# EAGLE schematic circuit (EAGLE 6.5.0)

## Sheet 1 of 5: Controller
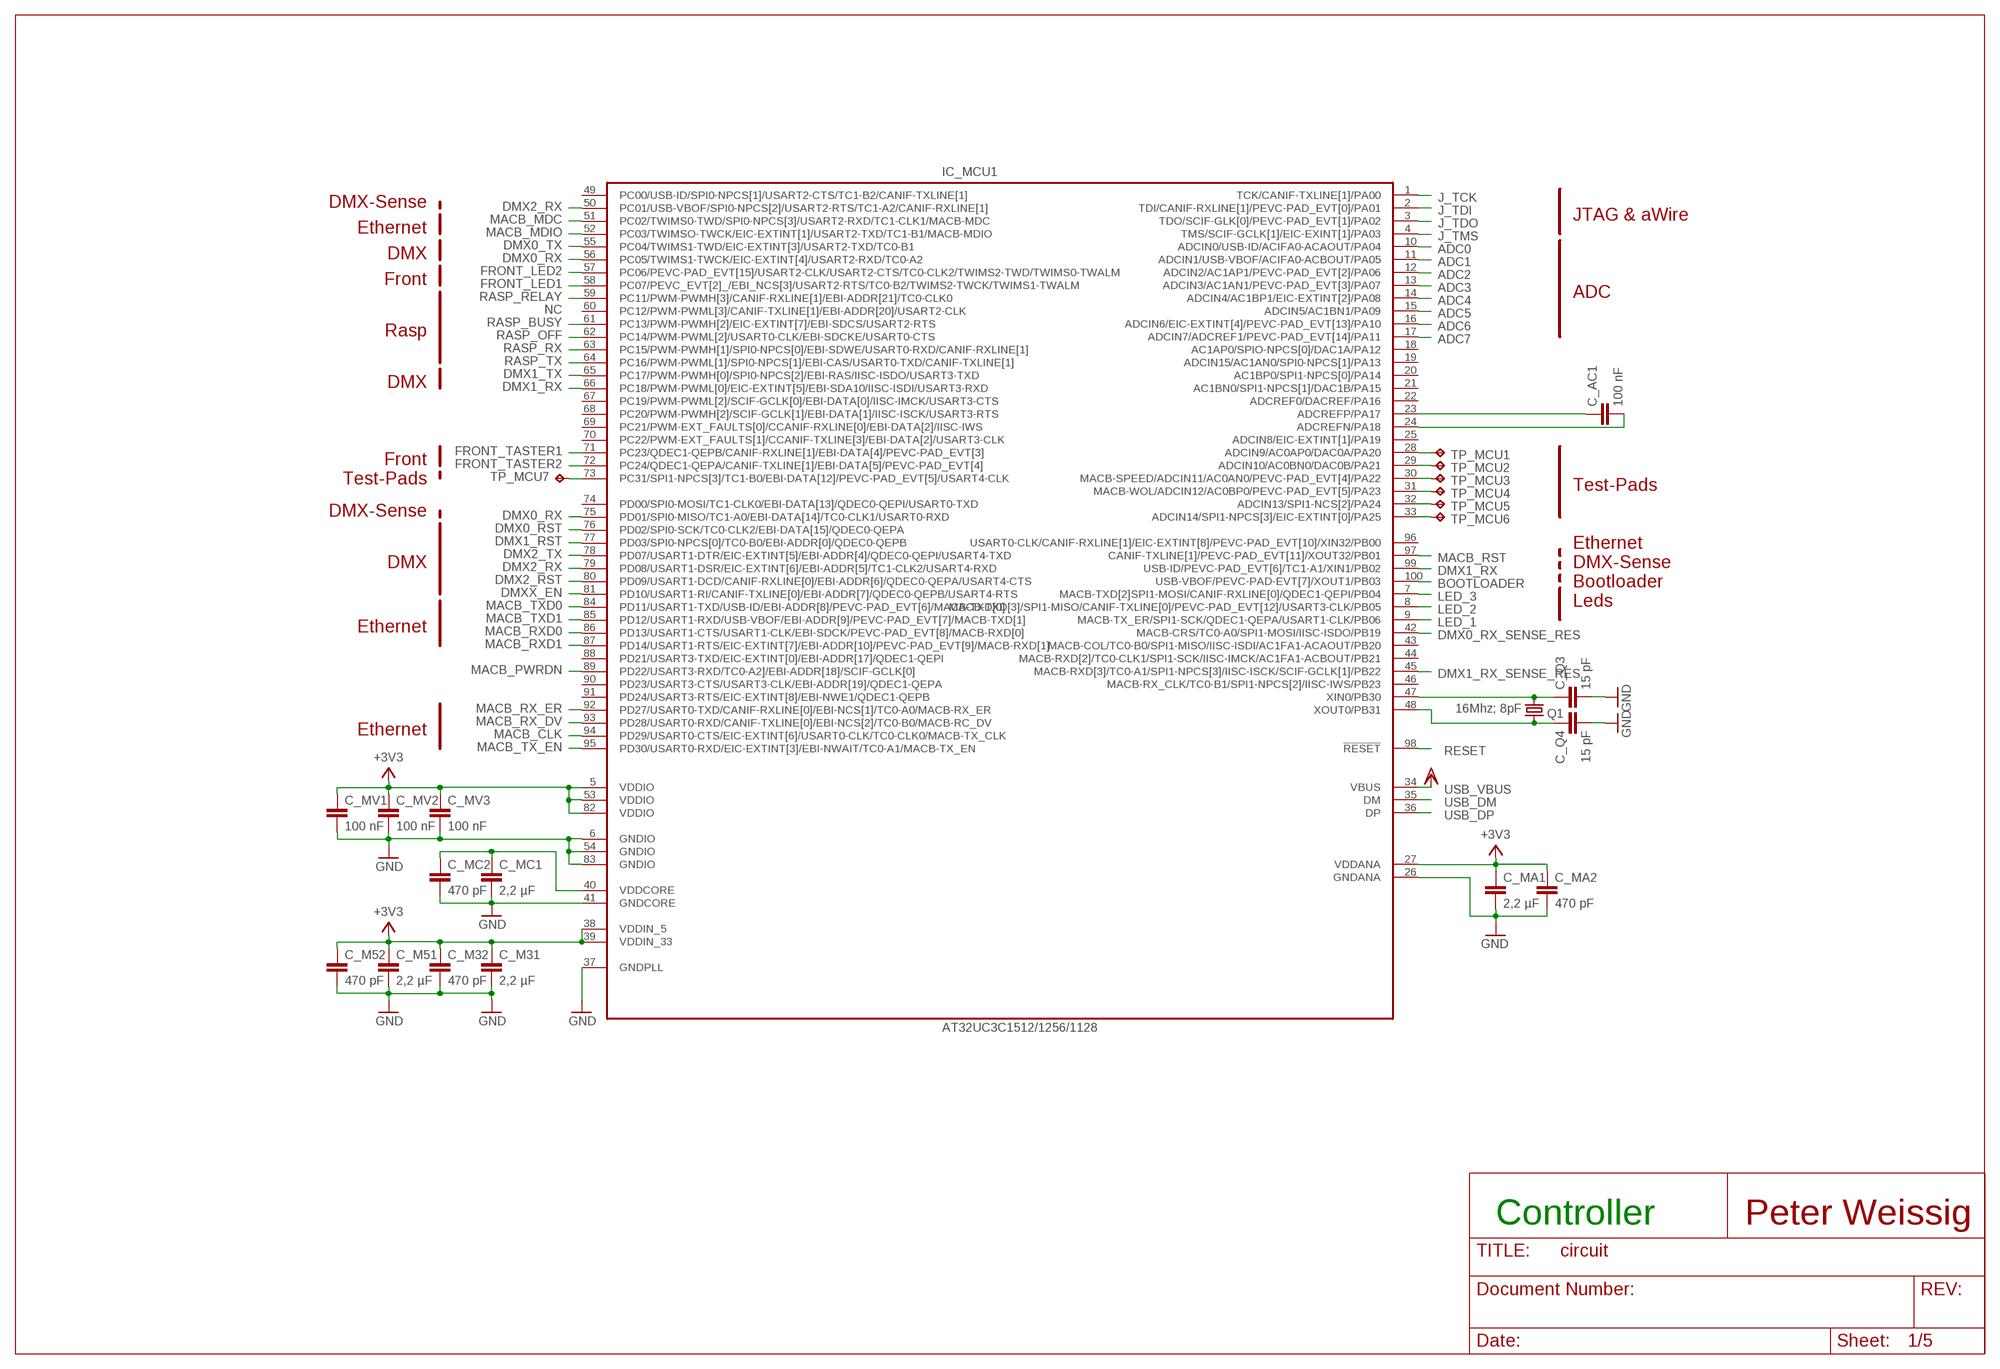
[diagram p0: schematic, sheet 1]

### Parts
C_AC1  100 nF  C-EUC0603K  [C0603K]
C_M31  2,2 µF  C-EUC0603K  [C0603K]
C_M32  470 pF  C-EUC0603K  [C0603K]
C_M51  2,2 µF  C-EUC0603K  [C0603K]
C_M52  470 pF  C-EUC0603K  [C0603K]
C_MA1  2,2 µF  C-EUC0603K  [C0603K]
C_MA2  470 pF  C-EUC0603K  [C0603K]
C_MC1  2,2 µF  C-EUC0603K  [C0603K]
C_MC2  470 pF  C-EUC0603K  [C0603K]
C_MV1  100 nF  C-EUC0603K  [C0603K]
C_MV2  100 nF  C-EUC0603K  [C0603K]
C_MV3  100 nF  C-EUC0603K  [C0603K]
C_Q3  15 pF  C-EUC0603K  [C0603K]
C_Q4  15 pF  C-EUC0603K  [C0603K]
IC_MCU1  AT32UC3C1512/1256/1128  [TQFP100]
Q1  16Mhz; 8pF  CRYSTALNX5032  [NX5032]
TP_MCU1  TPTP15R  [TP15R]
TP_MCU2  TPTP15R  [TP15R]
TP_MCU3  TPTP15R  [TP15R]
TP_MCU4  TPTP15R  [TP15R]
TP_MCU5  TPTP15R  [TP15R]
TP_MCU6  TPTP15R  [TP15R]
TP_MCU7  TPTP15R  [TP15R]

### Nets
+3V3: C_M31.1 C_M32.1 C_M51.1 C_M52.1 C_MA1.1 C_MA2.1 C_MV1.1 C_MV2.1 C_MV3.1 IC_MCU1.5(VDDIO) IC_MCU1.27(VDDANA) IC_MCU1.38(VDDIN_5) IC_MCU1.39(VDDIN_33) IC_MCU1.53(VDDIO) IC_MCU1.82(VDDIO) ; also sheet 2,3,4,5
ADC0: IC_MCU1.10(ADCIN0/USB-ID/ACIFA0-ACAOUT/PA04) ; also sheet 3
ADC1: IC_MCU1.11(ADCIN1/USB-VBOF/ACIFA0-ACBOUT/PA05) ; also sheet 3
ADC2: IC_MCU1.12(ADCIN2/AC1AP1/PEVC-PAD_EVT[2]/PA06) ; also sheet 3
ADC3: IC_MCU1.13(ADCIN3/AC1AN1/PEVC-PAD_EVT[3]/PA07) ; also sheet 3
ADC4: IC_MCU1.14(ADCIN4/AC1BP1/EIC-EXTINT[2]/PA08) ; also sheet 3
ADC5: IC_MCU1.15(ADCIN5/AC1BN1/PA09) ; also sheet 3
ADC6: IC_MCU1.16(ADCIN6/EIC-EXTINT[4]/PEVC-PAD_EVT[13]/PA10) ; also sheet 3
ADC7: IC_MCU1.17(ADCIN7/ADCREF1/PEVC-PAD_EVT[14]/PA11) ; also sheet 3
BOOTLOADER: IC_MCU1.100(USB-VBOF/PEVC-PAD-EVT[7]/XOUT1/PB03) ; also sheet 3
DMX0_RST: IC_MCU1.76(PD02/SPI0-SCK/TC0-CLK2/EBI-DATA[15]/QDEC0-QEPA) ; also sheet 4
DMX0_RX: IC_MCU1.56(PC05/TWIMS1-TWCK/EIC-EXTINT[4]/USART2-RXD/TC0-A2) IC_MCU1.75(PD01/SPI0-MISO/TC1-A0/EBI-DATA[14]/TC0-CLK1/USART0-RXD) ; also sheet 4
DMX0_RX_SENSE_RES: IC_MCU1.42(MACB-CRS/TC0-A0/SPI1-MOSI/IISC-ISDO/PB19)
DMX0_TX: IC_MCU1.55(PC04/TWIMS1-TWD/EIC-EXTINT[3]/USART2-TXD/TC0-B1) ; also sheet 4
DMX1_RST: IC_MCU1.77(PD03/SPI0-NPCS[0]/TC0-B0/EBI-ADDR[0]/QDEC0-QEPB) ; also sheet 4
DMX1_RX: IC_MCU1.66(PC18/PWM-PWML[0]/EIC-EXTINT[5]/EBI-SDA10/IISC-ISDI/USART3-RXD) IC_MCU1.99(USB-ID/PEVC-PAD_EVT[6]/TC1-A1/XIN1/PB02) ; also sheet 4
DMX1_RX_SENSE_RES: IC_MCU1.45(MACB-RXD[3]/TC0-A1/SPI1-NPCS[3]/IISC-ISCK/SCIF-GCLK[1]/PB22)
DMX1_TX: IC_MCU1.65(PC17/PWM-PWMH[0]/SPI0-NPCS[2]/EBI-RAS/IISC-ISDO/USART3-TXD) ; also sheet 4
DMX2_RST: IC_MCU1.80(PD09/USART1-DCD/CANIF-RXLINE[0]/EBI-ADDR[6]/QDEC0-QEPA/USART4-CTS) ; also sheet 4
DMX2_RX: IC_MCU1.50(PC01/USB-VBOF/SPI0-NPCS[2]/USART2-RTS/TC1-A2/CANIF-RXLINE[1]) IC_MCU1.79(PD08/USART1-DSR/EIC-EXTINT[6]/EBI-ADDR[5]/TC1-CLK2/USART4-RXD) ; also sheet 4
DMX2_TX: IC_MCU1.78(PD07/USART1-DTR/EIC-EXTINT[5]/EBI-ADDR[4]/QDEC0-QEPI/USART4-TXD) ; also sheet 4
DMXX_EN: IC_MCU1.81(PD10/USART1-RI/CANIF-TXLINE[0]/EBI-ADDR[7]/QDEC0-QEPB/USART4-RTS) ; also sheet 4
FRONT_LED1: IC_MCU1.58(PC07/PEVC_EVT[2]_/EBI_NCS[3]/USART2-RTS/TC0-B2/TWIMS2-TWCK/TWIMS1-TWALM) ; also sheet 3
FRONT_LED2: IC_MCU1.57(PC06/PEVC-PAD_EVT[15]/USART2-CLK/USART2-CTS/TC0-CLK2/TWIMS2-TWD/TWIMS0-TWALM) ; also sheet 3
FRONT_TASTER1: IC_MCU1.71(PC23/QDEC1-QEPB/CANIF-RXLINE[1]/EBI-DATA[4]/PEVC-PAD_EVT[3]) ; also sheet 3
FRONT_TASTER2: IC_MCU1.72(PC24/QDEC1-QEPA/CANIF-TXLINE[1]/EBI-DATA[5]/PEVC-PAD_EVT[4]) ; also sheet 3
FRONT_TASTER3: IC_MCU1.73(PC31/SPI1-NPCS[3]/TC1-B0/EBI-DATA[12]/PEVC-PAD_EVT[5]/USART4-CLK) TP_MCU7.TP
GND: C_M31.2 C_M32.2 C_M51.2 C_M52.2 C_MA1.2 C_MA2.2 C_MC1.2 C_MC2.2 C_MV1.2 C_MV2.2 C_MV3.2 C_Q3.2 C_Q4.2 IC_MCU1.6(GNDIO) IC_MCU1.26(GNDANA) IC_MCU1.37(GNDPLL) IC_MCU1.41(GNDCORE) IC_MCU1.54(GNDIO) IC_MCU1.83(GNDIO) ; also sheet 2,3,4,5
J_TCK: IC_MCU1.1(TCK/CANIF-TXLINE[1]/PA00) ; also sheet 3
J_TDI: IC_MCU1.2(TDI/CANIF-RXLINE[1]/PEVC-PAD_EVT[0]/PA01) ; also sheet 3
J_TDO: IC_MCU1.3(TDO/SCIF-GLK[0]/PEVC-PAD_EVT[1]/PA02) ; also sheet 3
J_TMS: IC_MCU1.4(TMS/SCIF-GCLK[1]/EIC-EXINT[1]/PA03) ; also sheet 3
LED_1: IC_MCU1.9(MACB-TX_ER/SPI1-SCK/QDEC1-QEPA/USART1-CLK/PB06) ; also sheet 3
LED_2: IC_MCU1.8(MACB-TXD[3]/SPI1-MISO/CANIF-TXLINE[0]/PEVC-PAD_EVT[12]/USART3-CLK/PB05) ; also sheet 3
LED_3: IC_MCU1.7(MACB-TXD[2]SPI1-MOSI/CANIF-RXLINE[0]/QDEC1-QEPI/PB04) ; also sheet 3
MACB_CLK: IC_MCU1.94(PD29/USART0-CTS/EIC-EXTINT[6]/USART0-CLK/TC0-CLK0/MACB-TX_CLK) ; also sheet 2
MACB_MDC: IC_MCU1.51(PC02/TWIMS0-TWD/SPI0-NPCS[3]/USART2-RXD/TC1-CLK1/MACB-MDC) ; also sheet 2
MACB_MDIO: IC_MCU1.52(PC03/TWIMSO-TWCK/EIC-EXTINT[1]/USART2-TXD/TC1-B1/MACB-MDIO) ; also sheet 2
MACB_PWRDN: IC_MCU1.89(PD22/USART3-RXD/TC0-A2]/EBI-ADDR[18]/SCIF-GCLK[0]) ; also sheet 2
MACB_RST: IC_MCU1.97(CANIF-TXLINE[1]/PEVC-PAD_EVT[11]/XOUT32/PB01) ; also sheet 2
MACB_RX_DV: IC_MCU1.93(PD28/USART0-RXD/CANIF-TXLINE[0]/EBI-NCS[2]/TC0-B0/MACB-RC_DV) ; also sheet 2
MACB_RX_ER: IC_MCU1.92(PD27/USART0-TXD/CANIF-RXLINE[0]/EBI-NCS[1]/TC0-A0/MACB-RX_ER) ; also sheet 2
MACB_RXD0: IC_MCU1.86(PD13/USART1-CTS/USART1-CLK/EBI-SDCK/PEVC-PAD_EVT[8]/MACB-RXD[0]) ; also sheet 2
MACB_RXD1: IC_MCU1.87(PD14/USART1-RTS/EIC-EXTINT[7]/EBI-ADDR[10]/PEVC-PAD_EVT[9]/MACB-RXD[1]) ; also sheet 2
MACB_TX_EN: IC_MCU1.95(PD30/USART0-RXD/EIC-EXTINT[3]/EBI-NWAIT/TC0-A1/MACB-TX_EN) ; also sheet 2
MACB_TXD0: IC_MCU1.84(PD11/USART1-TXD/USB-ID/EBI-ADDR[8]/PEVC-PAD_EVT[6]/MACB-TXD[0]) ; also sheet 2
MACB_TXD1: IC_MCU1.85(PD12/USART1-RXD/USB-VBOF/EBI-ADDR[9]/PEVC-PAD_EVT[7]/MACB-TXD[1]) ; also sheet 2
N$1: C_MC1.1 C_MC2.1 IC_MCU1.40(VDDCORE)
N$2: C_Q3.1 IC_MCU1.47(XIN0/PB30) Q1.2
N$4: IC_MCU1.28(ADCIN9/AC0AP0/DAC0A/PA20) TP_MCU1.TP
N$6: C_Q4.1 IC_MCU1.48(XOUT0/PB31) Q1.1
N$11: IC_MCU1.29(ADCIN10/AC0BN0/DAC0B/PA21) TP_MCU2.TP
N$13: IC_MCU1.30(MACB-SPEED/ADCIN11/AC0AN0/PEVC-PAD_EVT[4]/PA22) TP_MCU3.TP
N$25: C_AC1.1 IC_MCU1.23(ADCREFP/PA17)
N$26: C_AC1.2 IC_MCU1.24(ADCREFN/PA18)
N$30: IC_MCU1.31(MACB-WOL/ADCIN12/AC0BP0/PEVC-PAD_EVT[5]/PA23) TP_MCU4.TP
N$31: IC_MCU1.32(ADCIN13/SPI1-NCS[2]/PA24) TP_MCU5.TP
N$32: IC_MCU1.33(ADCIN14/SPI1-NPCS[3]/EIC-EXTINT[0]/PA25) TP_MCU6.TP
RASP_BUSY: IC_MCU1.61(PC13/PWM-PWMH[2]/EIC-EXTINT[7]/EBI-SDCS/USART2-RTS) ; also sheet 5
RASP_OFF: IC_MCU1.62(PC14/PWM-PWML[2]/USART0-CLK/EBI-SDCKE/USART0-CTS) ; also sheet 5
RASP_RELAY: IC_MCU1.59(PC11/PWM-PWMH[3]/CANIF-RXLINE[1]/EBI-ADDR[21]/TC0-CLK0) ; also sheet 3
RASP_RX: IC_MCU1.63(PC15/PWM-PWMH[1]/SPI0-NPCS[0]/EBI-SDWE/USART0-RXD/CANIF-RXLINE[1]) ; also sheet 5
RASP_TX: IC_MCU1.64(PC16/PWM-PWML[1]/SPI0-NPCS[1]/EBI-CAS/USART0-TXD/CANIF-TXLINE[1]) ; also sheet 5
RESET: IC_MCU1.98(!RESET) ; also sheet 3
USB_DM: IC_MCU1.35(DM) ; also sheet 3
USB_DP: IC_MCU1.36(DP) ; also sheet 3
USB_VBUS: IC_MCU1.34(VBUS) ; supply symbol labelled VDD ; also sheet 3
Unconnected: IC_MCU1.18(AC1AP0/SPIO-NPCS[0]/DAC1A/PA12) IC_MCU1.19(ADCIN15/AC1AN0/SPI0-NPCS[1]/PA13) IC_MCU1.20(AC1BP0/SPI1-NPCS[0]/PA14) IC_MCU1.21(AC1BN0/SPI1-NPCS[1]/DAC1B/PA15) IC_MCU1.22(ADCREF0/DACREF/PA16) IC_MCU1.25(ADCIN8/EIC-EXTINT[1]/PA19) IC_MCU1.43(MACB-COL/TC0-B0/SPI1-MISO/IISC-ISDI/AC1FA1-ACAOUT/PB20) IC_MCU1.44(MACB-RXD[2]/TC0-CLK1/SPI1-SCK/IISC-IMCK/AC1FA1-ACBOUT/PB21) IC_MCU1.46(MACB-RX_CLK/TC0-B1/SPI1-NPCS[2]/IISC-IWS/PB23) IC_MCU1.49(PC00/USB-ID/SPI0-NPCS[1]/USART2-CTS/TC1-B2/CANIF-TXLINE[1]) IC_MCU1.60(PC12/PWM-PWML[3]/CANIF-TXLINE[1]/EBI-ADDR[20]/USART2-CLK) IC_MCU1.67(PC19/PWM-PWML[2]/SCIF-GCLK[0]/EBI-DATA[0]/IISC-IMCK/USART3-CTS) IC_MCU1.68(PC20/PWM-PWMH[2]/SCIF-GCLK[1]/EBI-DATA[1]/IISC-ISCK/USART3-RTS) IC_MCU1.69(PC21/PWM-EXT_FAULTS[0]/CCANIF-RXLINE[0]/EBI-DATA[2]/IISC-IWS) IC_MCU1.70(PC22/PWM-EXT_FAULTS[1]/CCANIF-TXLINE[3]/EBI-DATA[2]/USART3-CLK) IC_MCU1.74(PD00/SPI0-MOSI/TC1-CLK0/EBI-DATA[13]/QDEC0-QEPI/USART0-TXD) IC_MCU1.88(PD21/USART3-TXD/EIC-EXTINT[0]/EBI-ADDR[17]/QDEC1-QEPI) IC_MCU1.90(PD23/USART3-CTS/USART3-CLK/EBI-ADDR[19]/QDEC1-QEPA) IC_MCU1.91(PD24/USART3-RTS/EIC-EXTINT[8]/EBI-NWE1/QDEC1-QEPB) IC_MCU1.96(USART0-CLK/CANIF-RXLINE[1]/EIC-EXTINT[8]/PEVC-PAD_EVT[10]/XIN32/PB00)

### Notes on the sheet
- DMX-Sense
- JTAG & aWire
- Ethernet
- DMX
- Front
- ADC
- NC
- Rasp
- DMX
- Front
- Test-Pads
- Test-Pads
- DMX-Sense
- Ethernet
- DMX | DMX-Sense
- Bootloader
- Leds
- Ethernet
- Ethernet
- Controller | Peter Weissig

## Sheet 2 of 5: Ethernet
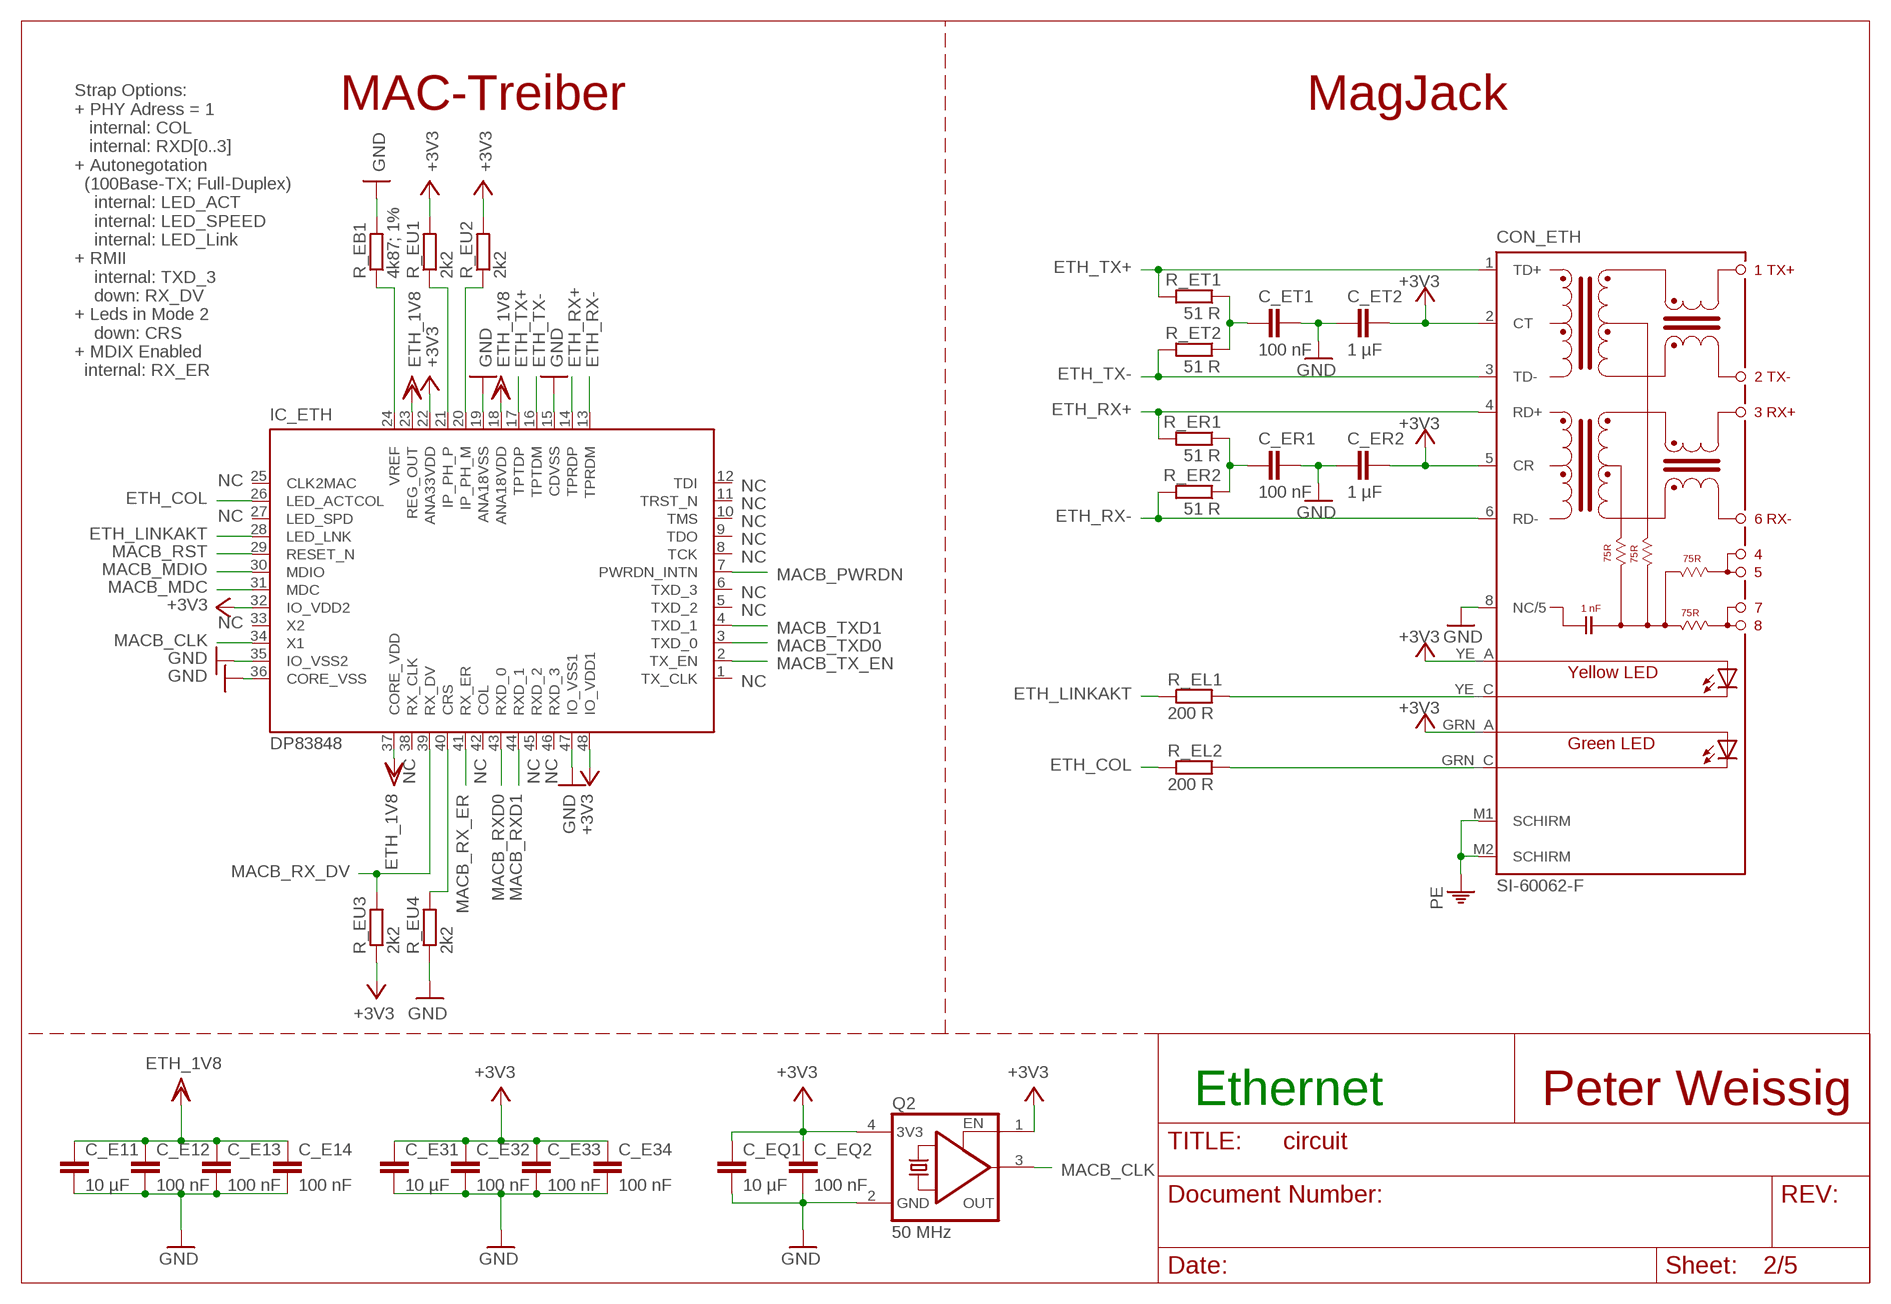
[diagram p1: schematic, sheet 2]

### Parts
C_E11  10 µF  C-EUC0603  [C0603]
C_E12  100 nF  C-EUC0603  [C0603]
C_E13  100 nF  C-EUC0603  [C0603]
C_E14  100 nF  C-EUC0603  [C0603]
C_E31  10 µF  C-EUC0603  [C0603]
C_E32  100 nF  C-EUC0603  [C0603]
C_E33  100 nF  C-EUC0603  [C0603]
C_E34  100 nF  C-EUC0603  [C0603]
C_EQ1  10 µF  C-EUC0603  [C0603]
C_EQ2  100 nF  C-EUC0603  [C0603]
C_ER1  100 nF  C-EUC0603  [C0603]
C_ER2  1 µF  C-EUC0603  [C0603]
C_ET1  100 nF  C-EUC0603  [C0603]
C_ET2  1 µF  C-EUC0603  [C0603]
CON_ETH  SI-60062-F  [MAG_JACK]
IC_ETH  DP83848  [LQFP48]
Q2  50 MHz  OSZILLATOR  [XO53]
R_EB1  4k87; 1%  R-EU_R0603  [R0603]
R_EL1  200 R  R-EU_R0603  [R0603]
R_EL2  200 R  R-EU_R0603  [R0603]
R_ER1  51 R  R-EU_R0603  [R0603]
R_ER2  51 R  R-EU_R0603  [R0603]
R_ET1  51 R  R-EU_R0603  [R0603]
R_ET2  51 R  R-EU_R0603  [R0603]
R_EU1  2k2  R-EU_R0603  [R0603]
R_EU2  2k2  R-EU_R0603  [R0603]
R_EU3  2k2  R-EU_R0603  [R0603]
R_EU4  2k2  R-EU_R0603  [R0603]

### Nets
+3V3: C_E31.1 C_E32.1 C_E33.1 C_E34.1 C_EQ1.1 C_EQ2.1 C_ER2.2 C_ET2.2 CON_ETH.2(CT) CON_ETH.5(CR) CON_ETH.GRN_A(AL) CON_ETH.YE_A(A-R) IC_ETH.22(ANA33VDD) IC_ETH.32(IO_VDD2) IC_ETH.48(IO_VDD1) Q2.1(EN) Q2.4(3V3) R_EU1.2 R_EU2.2 R_EU3.1 ; also sheet 1,3,4,5
ETH_1V8: C_E11.1 C_E12.1 C_E13.1 C_E14.1 IC_ETH.18(ANA18VDD) IC_ETH.23(REG_OUT) IC_ETH.37(CORE_VDD) ; supply symbol labelled VDD
ETH_COL: IC_ETH.26(LED_ACTCOL) R_EL2.1
ETH_LINKAKT: IC_ETH.28(LED_LNK) R_EL1.1
ETH_RX+: CON_ETH.4(RD+) IC_ETH.14(TPRDP) R_ER1.2
ETH_RX-: CON_ETH.6(RD-) IC_ETH.13(TPRDM) R_ER2.2
ETH_TX+: CON_ETH.1(TD+) IC_ETH.17(TPTDP) R_ET1.2
ETH_TX-: CON_ETH.3(TD-) IC_ETH.16(TPTDM) R_ET2.2
GND: C_E11.2 C_E12.2 C_E13.2 C_E14.2 C_E31.2 C_E32.2 C_E33.2 C_E34.2 C_EQ1.2 C_EQ2.2 C_ER1.2 C_ER2.1 C_ET1.2 C_ET2.1 CON_ETH.8(NC/5) IC_ETH.15(CDVSS) IC_ETH.19(ANA18VSS) IC_ETH.35(IO_VSS2) IC_ETH.36(CORE_VSS) IC_ETH.47(IO_VSS1) Q2.2(GND) R_EB1.2 R_EU4.1 ; also sheet 1,3,4,5
MACB_CLK: IC_ETH.34(X1) Q2.3(OUT) ; also sheet 1
MACB_MDC: IC_ETH.31(MDC) ; also sheet 1
MACB_MDIO: IC_ETH.30(MDIO) ; also sheet 1
MACB_PWRDN: IC_ETH.7(PWRDN_INTN) ; also sheet 1
MACB_RST: IC_ETH.29(RESET_N) ; also sheet 1
MACB_RX_DV: IC_ETH.39(RX_DV) R_EU3.2 ; also sheet 1
MACB_RX_ER: IC_ETH.41(RX_ER) ; also sheet 1
MACB_RXD0: IC_ETH.43(RXD_0) ; also sheet 1
MACB_RXD1: IC_ETH.44(RXD_1) ; also sheet 1
MACB_TX_EN: IC_ETH.2(TX_EN) ; also sheet 1
MACB_TXD0: IC_ETH.3(TXD_0) ; also sheet 1
MACB_TXD1: IC_ETH.4(TXD_1) ; also sheet 1
N$14: IC_ETH.24(VREF) R_EB1.1
N$15: IC_ETH.21(IP_PH_P) R_EU1.1
N$16: IC_ETH.20(IP_PH_M) R_EU2.1
N$17: IC_ETH.40(CRS) R_EU4.2
N$41: CON_ETH.YE_C(C-R) R_EL1.2
N$42: CON_ETH.GRN_C(C-L) R_EL2.2
N$43: C_ER1.1 R_ER1.1 R_ER2.1
N$44: C_ET1.1 R_ET1.1 R_ET2.1
PE: CON_ETH.M1(SCHIRM) CON_ETH.M2(SCHIRM) ; also sheet 3,5
Unconnected: IC_ETH.1(TX_CLK) IC_ETH.5(TXD_2) IC_ETH.6(TXD_3) IC_ETH.8(TCK) IC_ETH.9(TDO) IC_ETH.10(TMS) IC_ETH.11(TRST_N) IC_ETH.12(TDI) IC_ETH.25(CLK2MAC) IC_ETH.27(LED_SPD) IC_ETH.33(X2) IC_ETH.38(RX_CLK) IC_ETH.42(COL) IC_ETH.45(RXD_2) IC_ETH.46(RXD_3)

### Notes on the sheet
- MAC-Treiber | MagJack
- ETH_1V8 | ETH_1V8
- Strap Options:
  + PHY Adress = 1
     internal: COL
     internal: RXD[0..3]
  + Autonegotation
    (100Base-TX; Full-Duplex)
      internal: LED_ACT
      internal: LED_SPEED
      internal: LED_Link
  + RMII
      internal: TXD_3
      down: RX_DV
  + Leds in Mode 2
      down: CRS
  + MDIX Enabled
    internal: RX_ER
- NC
- NC
- NC | NC
- NC
- NC
- NC
- NC
- NC | NC
- NC
- NC | NC | NC | NC
- ETH_1V8
- ETH_1V8
- Ethernet | Peter Weissig

## Sheet 3 of 5: Schnittstellen
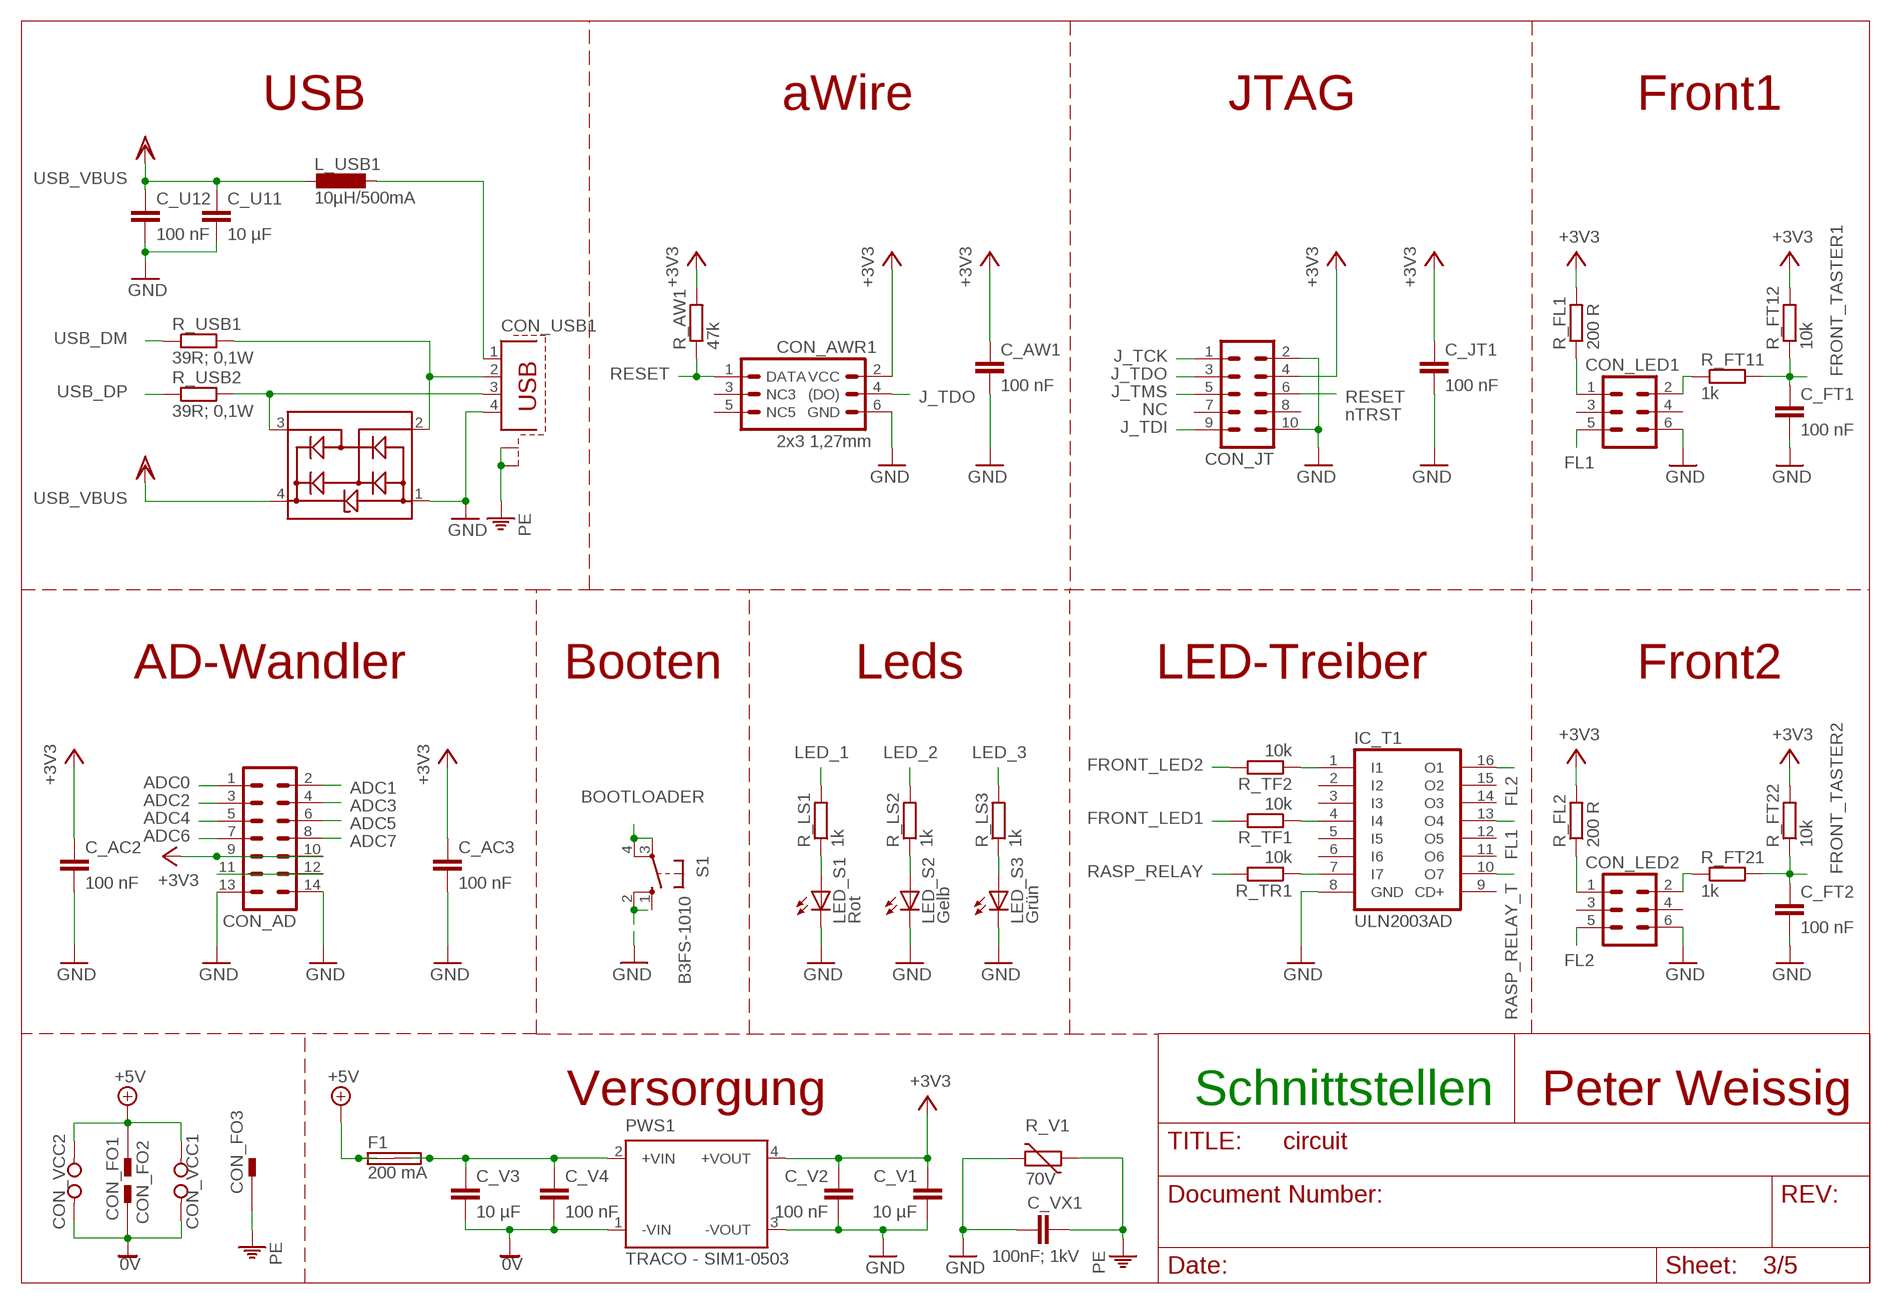
[diagram p2: schematic, sheet 3]

### Parts
C_AC2  100 nF  C-EUC0603K  [C0603K]
C_AC3  100 nF  C-EUC0603K  [C0603K]
C_AW1  100 nF  C-EUC0603K  [C0603K]
C_FT1  100 nF  C-EUC0603K  [C0603K]
C_FT2  100 nF  C-EUC0603K  [C0603K]
C_JT1  100 nF  C-EUC0603K  [C0603K]
C_U11  10 µF  C-EUC0805K  [C0805K]
C_U12  100 nF  C-EUC0603K  [C0603K]
C_V1  10 µF  C-EUC0603K  [C0603K]
C_V2  100 nF  C-EUC0603K  [C0603K]
C_V3  10 µF  C-EUC0603K  [C0603K]
C_V4  100 nF  C-EUC0603K  [C0603K]
C_VX1  100nF; 1kV  C-EUC1812K  [C1812K]
CON_AD  ML14  [ML14]
CON_AWR1  2x3 1,27mm  AWIREMINI  [2X3_MINI]
CON_FO1  PIN2F061.100  [F061.100]
CON_FO2  PIN2F061.100  [F061.100]
CON_FO3  PIN2F061.100  [F061.100]
CON_JT  ML10  [ML10]
CON_LED1  ML6  [ML6]
CON_LED2  ML6  [ML6]
CON_USB1  PN61729-S  [PN61729-S]
CON_VCC1  W237-02P  [W237-132]
CON_VCC2  W237-02P  [W237-132]
D1  PRTR5V0U2X  [SOT143-R]
F1  200 mA  SHK20L  [SHK20L]
IC_T1  ULN2003AD  [SO16]
L_USB1  10µH/500mA  L-EUL1210  [L1210]
LED_S1  Rot  LEDCHIPLED_1206  [CHIPLED_1206]
LED_S2  Gelb  LEDCHIPLED_1206  [CHIPLED_1206]
LED_S3  Grün  LEDCHIPLED_1206  [CHIPLED_1206]
PWS1  TRACO - SIM1-0503  TRACO-TME1  [TRACO_TME_1]
R_AW1  47k  R-EU_R0603  [R0603]
R_FL1  200 R  R-EU_R0603  [R0603]
R_FL2  200 R  R-EU_R0603  [R0603]
R_FT11  1k  R-EU_R0603  [R0603]
R_FT12  10k  R-EU_R0603  [R0603]
R_FT21  1k  R-EU_R0603  [R0603]
R_FT22  10k  R-EU_R0603  [R0603]
R_LS1  1k  R-EU_R0603  [R0603]
R_LS2  1k  R-EU_R0603  [R0603]
R_LS3  1k  R-EU_R0603  [R0603]
R_TF1  10k  R-EU_R0603  [R0603]
R_TF2  10k  R-EU_R0603  [R0603]
R_TR1  10k  R-EU_R0603  [R0603]
R_USB1  39R; 0,1W  R-EU_R0603  [R0603]
R_USB2  39R; 0,1W  R-EU_R0603  [R0603]
R_V1  70V  VARISTORCN1206  [CT/CN1206]
S1  B3FS-1010  10-XX  [B3F-10XX]

### Nets
0V: C_V3.2 C_V4.2 CON_FO1.A1 CON_FO1.A2 CON_VCC1.2 CON_VCC2.2 PWS1.1(-VIN) ; also sheet 4,5
+3V3: C_AC2.1 C_AC3.1 C_AW1.1 C_JT1.1 C_V1.1 C_V2.1 CON_AD.9 CON_AD.10 CON_AWR1.2(VCC) CON_JT.4 PWS1.4(+VOUT) R_AW1.2 R_FL1.2 R_FL2.2 R_FT12.2 R_FT22.2 ; also sheet 1,2,4,5
+5V: CON_FO2.A1 CON_FO2.A2 CON_VCC1.1 CON_VCC2.1 F1.1A F1.1B ; also sheet 4,5
ADC0: CON_AD.1 ; also sheet 1
ADC1: CON_AD.2 ; also sheet 1
ADC2: CON_AD.3 ; also sheet 1
ADC3: CON_AD.4 ; also sheet 1
ADC4: CON_AD.5 ; also sheet 1
ADC5: CON_AD.6 ; also sheet 1
ADC6: CON_AD.7 ; also sheet 1
ADC7: CON_AD.8 ; also sheet 1
BOOTLOADER: S1.3(P) S1.4(P1) ; also sheet 1
FL1: CON_LED1.5 IC_T1.13(O4)
FL2: CON_LED2.5 IC_T1.16(O1)
FRONT_LED1: R_TF1.2 ; also sheet 1
FRONT_LED2: R_TF2.2 ; also sheet 1
FRONT_TASTER1: C_FT1.1 R_FT11.2 R_FT12.1 ; also sheet 1
FRONT_TASTER2: C_FT2.1 R_FT21.2 R_FT22.1 ; also sheet 1
GND: C_AC2.2 C_AC3.2 C_AW1.2 C_FT1.2 C_FT2.2 C_JT1.2 C_U11.2 C_U12.2 C_V1.2 C_V2.2 C_VX1.1 CON_AD.13 CON_AD.14 CON_AWR1.6(GND) CON_JT.2 CON_JT.10 CON_LED1.6 CON_LED2.6 CON_USB1.4 D1.1(GND) IC_T1.8(GND) LED_S1.C LED_S2.C LED_S3.C PWS1.3(-VOUT) R_V1.2 S1.1(S) S1.2(S1) ; also sheet 1,2,4,5
J_TCK: CON_JT.1 ; also sheet 1
J_TDI: CON_JT.9 ; also sheet 1
J_TDO: CON_AWR1.4((DO)) CON_JT.3 ; also sheet 1
J_TMS: CON_JT.5 ; also sheet 1
LED_1: R_LS1.2 ; also sheet 1
LED_2: R_LS2.2 ; also sheet 1
LED_3: R_LS3.2 ; also sheet 1
N$3: LED_S1.A R_LS1.1
N$7: LED_S2.A R_LS2.1
N$8: CON_USB1.3 D1.3(IN/OUT2) R_USB2.2
N$9: CON_USB1.2 D1.2(IN/OUT1) R_USB1.2
N$10: LED_S3.A R_LS3.1
N$12: CON_USB1.1 L_USB1.1
N$27: CON_AD.11 CON_AD.12
N$28: IC_T1.4(I4) R_TF1.1
N$33: CON_LED1.1 R_FL1.1
N$35: C_V3.1 C_V4.1 F1.2A F1.2B PWS1.2(+VIN)
N$37: CON_LED1.2 R_FT11.1
N$46: CON_LED2.1 R_FL2.1
N$47: CON_LED2.2 R_FT21.1
N$48: IC_T1.1(I1) R_TF2.1
N$49: IC_T1.7(I7) R_TR1.1
PE: C_VX1.2 CON_FO3.A1 CON_FO3.A2 CON_USB1.S1 CON_USB1.S2 R_V1.1 ; also sheet 2,5
RASP_RELAY: R_TR1.2 ; also sheet 1
RASP_RELAY_T: IC_T1.10(O7) ; also sheet 5
RESET: CON_AWR1.1(DATA) CON_JT.6 R_AW1.1 ; also sheet 1
USB_DM: R_USB1.1 ; also sheet 1
USB_DP: R_USB2.1 ; also sheet 1
USB_VBUS: C_U11.1 C_U12.1 D1.4(VDD) L_USB1.2 ; supply symbol labelled VDD ; also sheet 1
Unconnected: CON_AWR1.3(NC3) CON_AWR1.5(NC5) CON_JT.7 CON_JT.8 CON_LED1.3 CON_LED1.4 CON_LED2.3 CON_LED2.4 IC_T1.2(I2) IC_T1.3(I3) IC_T1.5(I5) IC_T1.6(I6) IC_T1.9(CD+) IC_T1.11(O6) IC_T1.12(O5) IC_T1.14(O3) IC_T1.15(O2)

### Notes on the sheet
- USB | aWire | JTAG | Front1
- NC
- nTRST
- AD-Wandler | Booten | Leds | LED-Treiber | Front2
- Versorgung | Schnittstellen | Peter Weissig
- CON_VCC2 | CON_VCC1

## Sheet 4 of 5: DMX
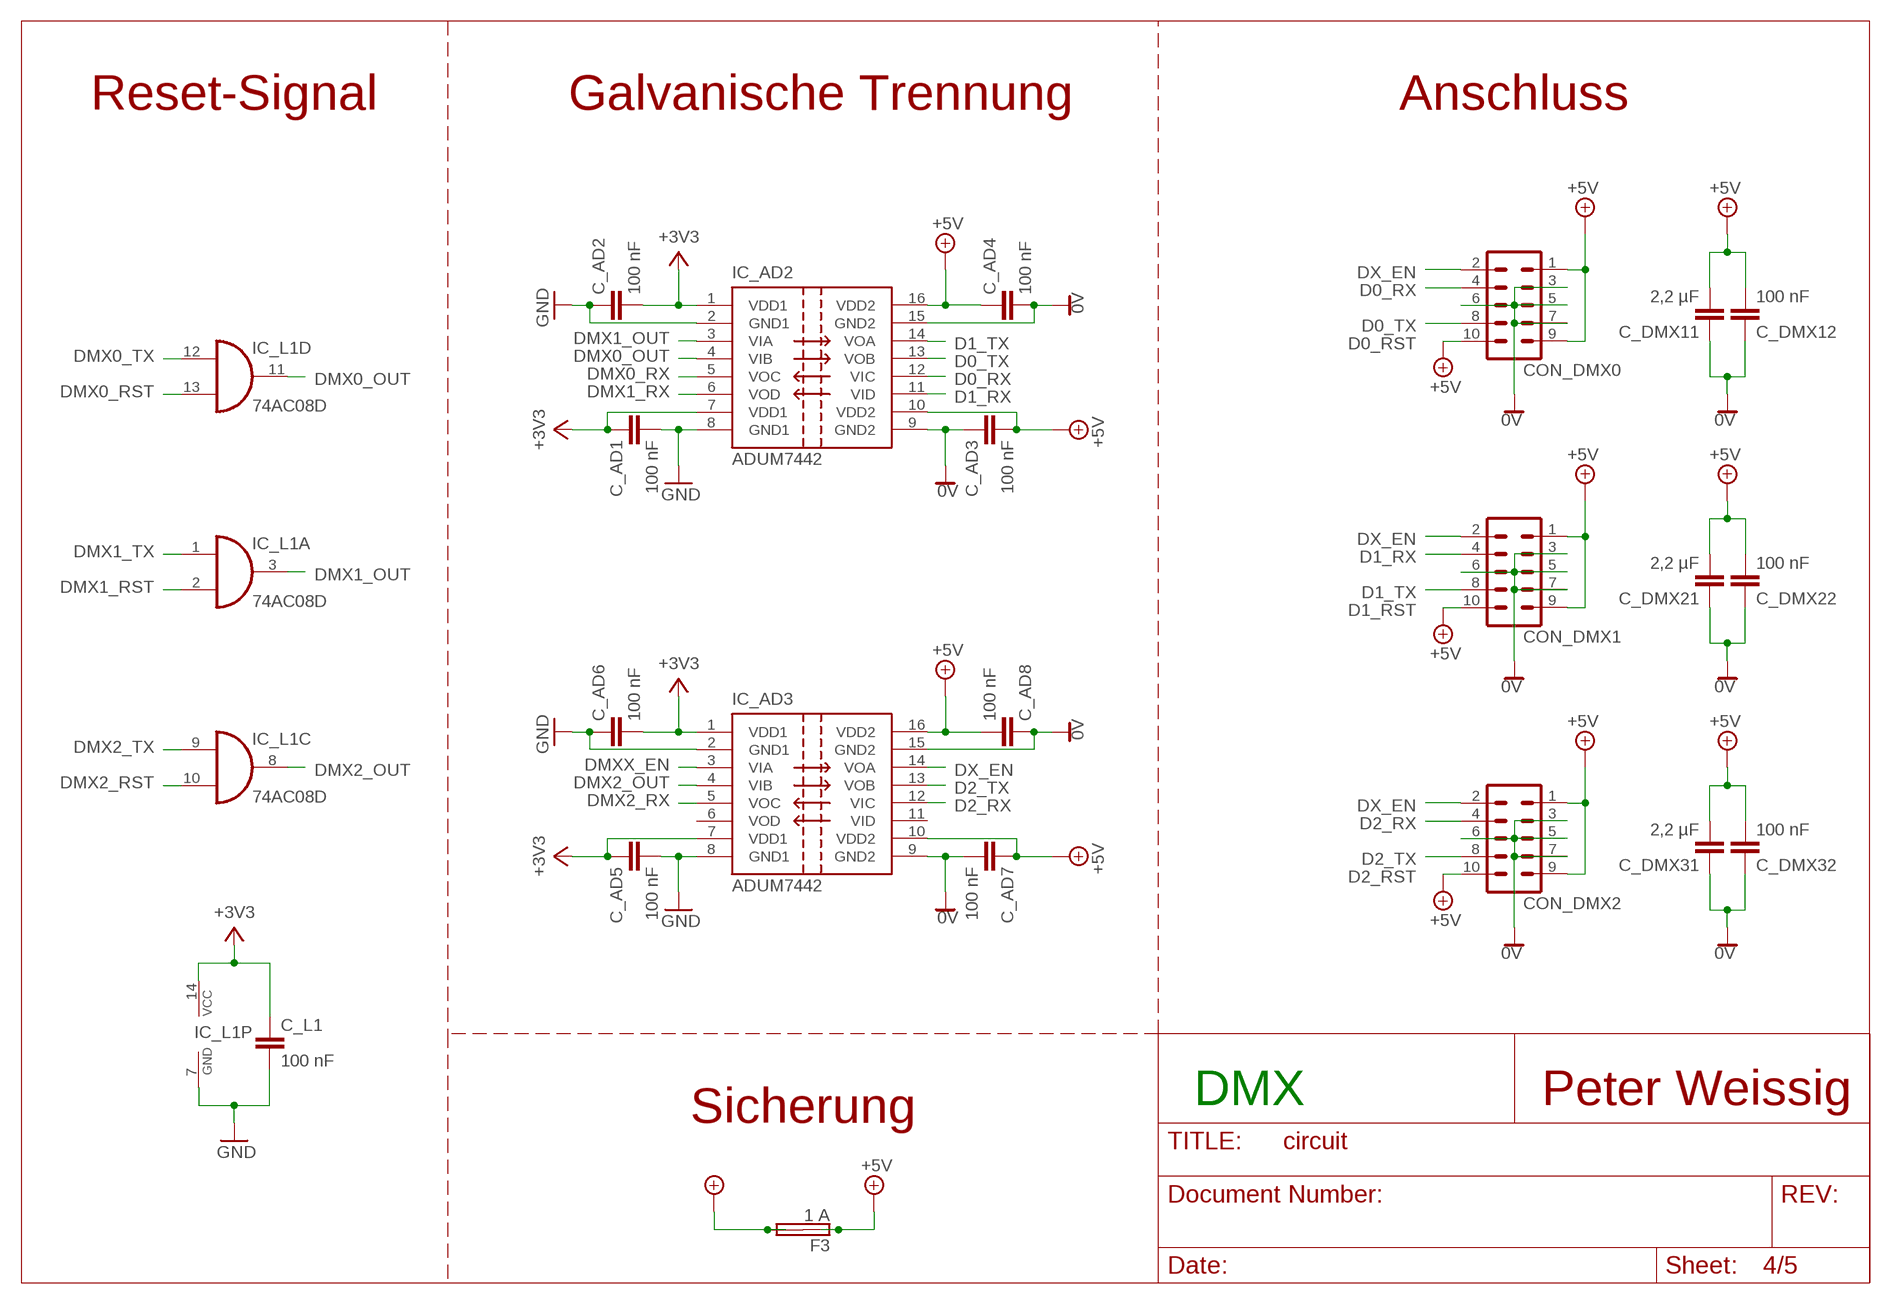
[diagram p3: schematic, sheet 4]

### Parts
C_AD1  100 nF  C-EUC0603K  [C0603K]
C_AD2  100 nF  C-EUC0603K  [C0603K]
C_AD3  100 nF  C-EUC0603K  [C0603K]
C_AD4  100 nF  C-EUC0603K  [C0603K]
C_AD5  100 nF  C-EUC0603K  [C0603K]
C_AD6  100 nF  C-EUC0603K  [C0603K]
C_AD7  100 nF  C-EUC0603K  [C0603K]
C_AD8  100 nF  C-EUC0603K  [C0603K]
C_DMX11  2,2 µF  C-EUC0603K  [C0603K]
C_DMX12  100 nF  C-EUC0603K  [C0603K]
C_DMX21  2,2 µF  C-EUC0603K  [C0603K]
C_DMX22  100 nF  C-EUC0603K  [C0603K]
C_DMX31  2,2 µF  C-EUC0603K  [C0603K]
C_DMX32  100 nF  C-EUC0603K  [C0603K]
C_L1  100 nF  C-EUC0603K  [C0603K]
CON_DMX0  ML10  [ML10]
CON_DMX1  ML10  [ML10]
CON_DMX2  ML10  [ML10]
F3  1 A  SHK20L  [SHK20L]
IC_AD2  ADUM7442  [SOP64P600X175-16N]
IC_AD3  ADUM7442  [SOP64P600X175-16N]
IC_L1  74AC08D  [SO14]

### Nets
0V: C_AD3.1 C_AD4.2 C_AD7.2 C_AD8.1 C_DMX11.1 C_DMX12.1 C_DMX21.1 C_DMX22.1 C_DMX31.1 C_DMX32.1 CON_DMX0.3 CON_DMX0.5 CON_DMX0.6 CON_DMX0.7 CON_DMX1.3 CON_DMX1.5 CON_DMX1.6 CON_DMX1.7 CON_DMX2.3 CON_DMX2.5 CON_DMX2.6 CON_DMX2.7 IC_AD2.9(GND2) IC_AD2.15(GND2) IC_AD3.9(GND2) IC_AD3.15(GND2) ; also sheet 3,5
+3V3: C_AD1.1 C_AD2.2 C_AD5.1 C_AD6.2 C_L1.1 IC_AD2.1(VDD1) IC_AD2.7(VDD1) IC_AD3.1(VDD1) IC_AD3.7(VDD1) IC_L1.14(P:VCC) ; also sheet 1,2,3,5
+5V: F3.2A F3.2B ; also sheet 3,5
D0_RX: CON_DMX0.4 IC_AD2.12(VIC)
D0_TX: CON_DMX0.8 IC_AD2.13(VOB)
D1_RX: CON_DMX1.4 IC_AD2.11(VID)
D1_TX: CON_DMX1.8 IC_AD2.14(VOA)
D2_RX: CON_DMX2.4 IC_AD3.12(VIC)
D2_TX: CON_DMX2.8 IC_AD3.13(VOB)
DMX0_OUT: IC_AD2.4(VIB) IC_L1.11(D:O)
DMX0_RST: IC_L1.13(D:I1) ; also sheet 1
DMX0_RX: IC_AD2.5(VOC) ; also sheet 1
DMX0_TX: IC_L1.12(D:I0) ; also sheet 1
DMX1_OUT: IC_AD2.3(VIA) IC_L1.3(A:O)
DMX1_RST: IC_L1.2(A:I1) ; also sheet 1
DMX1_RX: IC_AD2.6(VOD) ; also sheet 1
DMX1_TX: IC_L1.1(A:I0) ; also sheet 1
DMX2_OUT: IC_AD3.4(VIB) IC_L1.8(C:O)
DMX2_RST: IC_L1.10(C:I1) ; also sheet 1
DMX2_RX: IC_AD3.5(VOC) ; also sheet 1
DMX2_TX: IC_L1.9(C:I0) ; also sheet 1
DMXX_EN: IC_AD3.3(VIA) ; also sheet 1
DV_5V: C_AD3.2 C_AD4.1 C_AD7.1 C_AD8.2 C_DMX11.2 C_DMX12.2 C_DMX21.2 C_DMX22.2 C_DMX31.2 C_DMX32.2 CON_DMX0.1 CON_DMX0.9 CON_DMX0.10 CON_DMX1.1 CON_DMX1.9 CON_DMX1.10 CON_DMX2.1 CON_DMX2.9 CON_DMX2.10 F3.1A F3.1B IC_AD2.10(VDD2) IC_AD2.16(VDD2) IC_AD3.10(VDD2) IC_AD3.16(VDD2) ; supply symbol labelled +5V
DX_EN: CON_DMX0.2 CON_DMX1.2 CON_DMX2.2 IC_AD3.14(VOA)
GND: C_AD1.2 C_AD2.1 C_AD5.2 C_AD6.1 C_L1.2 IC_AD2.2(GND1) IC_AD2.8(GND1) IC_AD3.2(GND1) IC_AD3.8(GND1) IC_L1.7(P:GND) ; also sheet 1,2,3,5
Unconnected: IC_AD3.6(VOD) IC_AD3.11(VID) IC_L1.4(B:I0) IC_L1.5(B:I1) IC_L1.6(B:O)

### Notes on the sheet
- Reset-Signal | Galvanische Trennung | Anschluss
- D0_RST
- D1_RST
- D2_RST
- DMX | Peter Weissig
- Sicherung

## Sheet 5 of 5: Raspberry
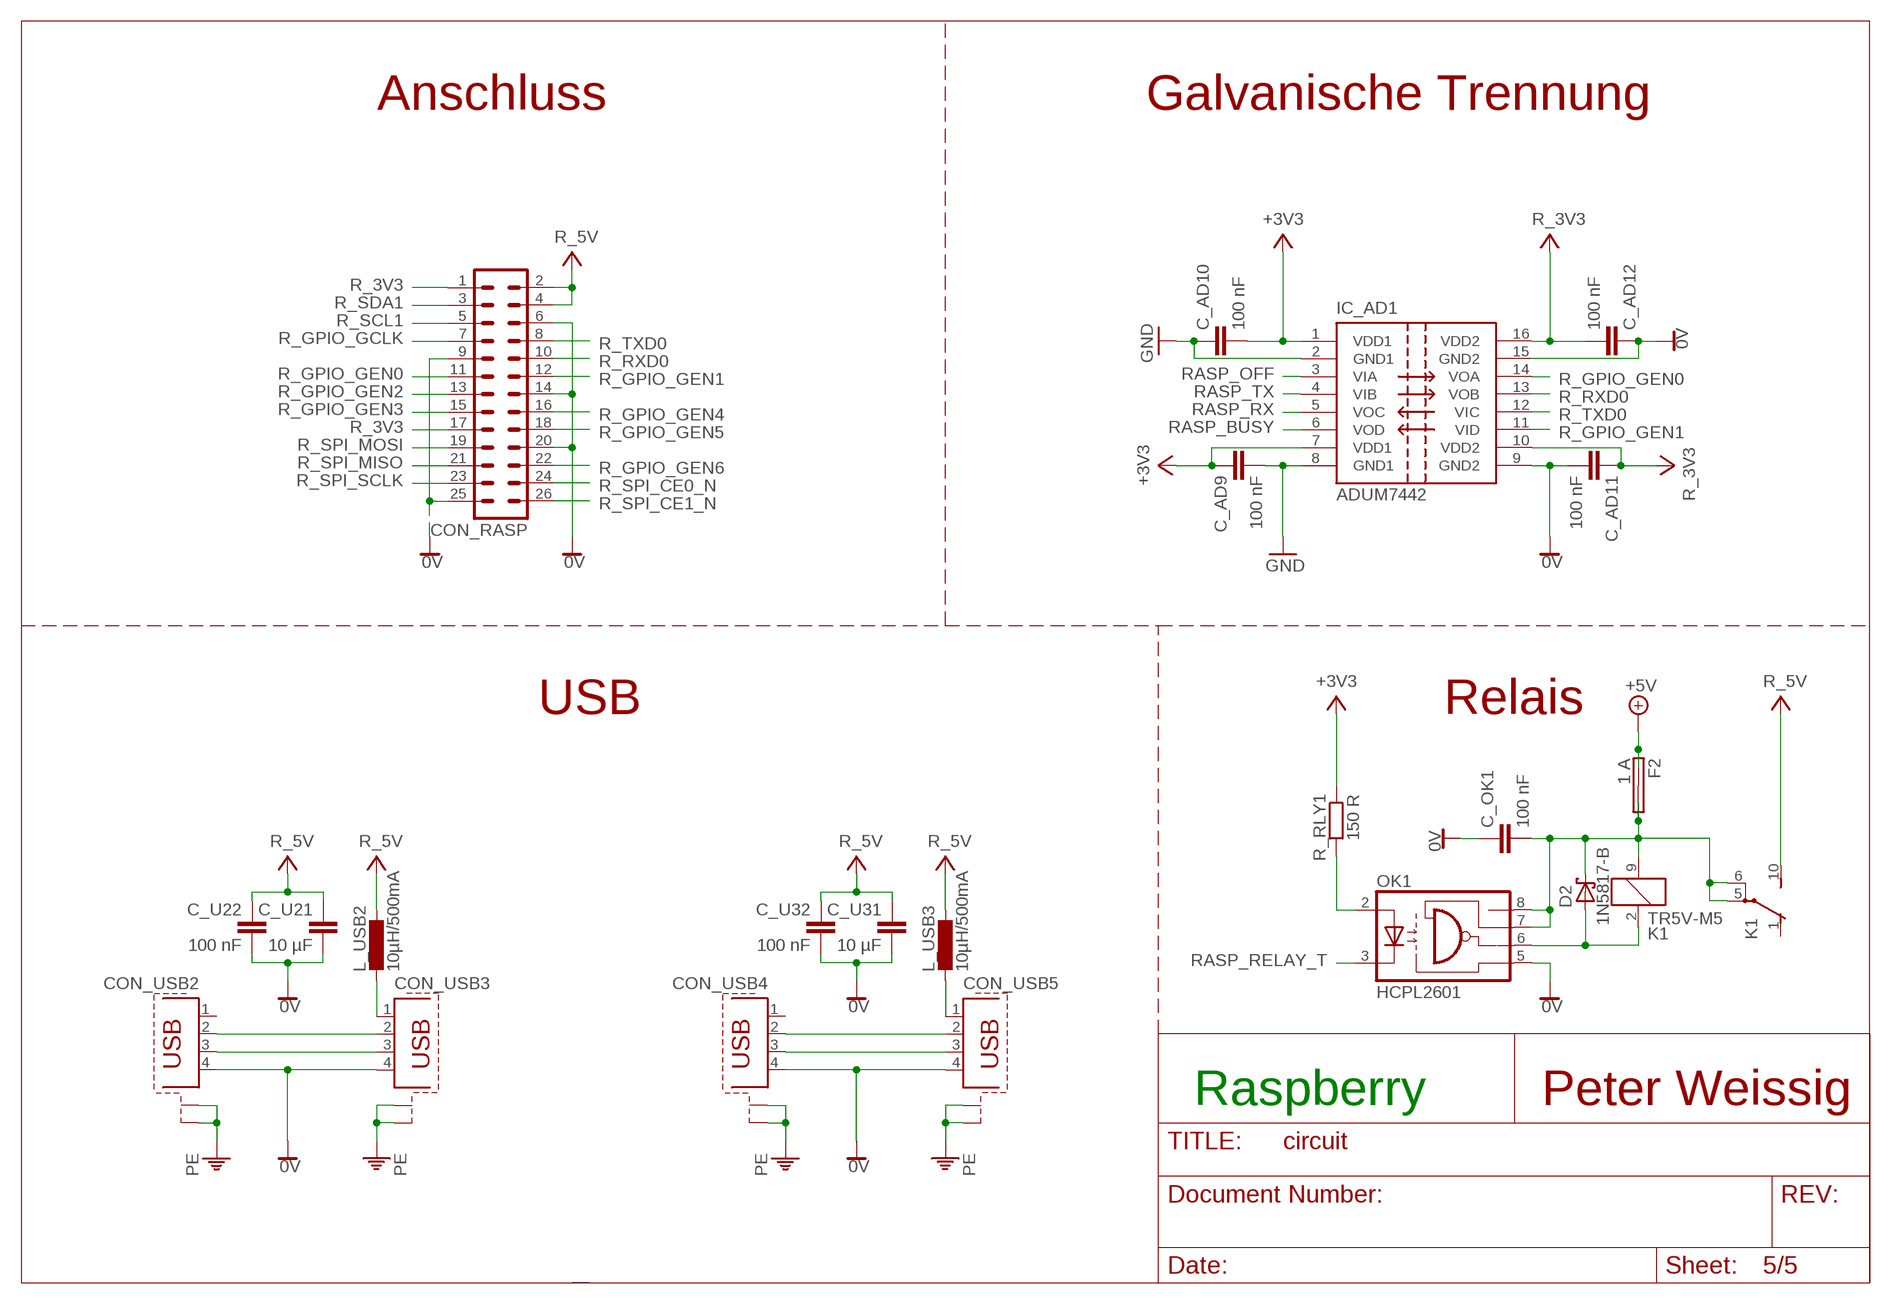
[diagram p4: schematic, sheet 5]

### Parts
C_AD9  100 nF  C-EUC0603K  [C0603K]
C_AD10  100 nF  C-EUC0603K  [C0603K]
C_AD11  100 nF  C-EUC0603K  [C0603K]
C_AD12  100 nF  C-EUC0603K  [C0603K]
C_OK1  100 nF  C-EUC0603K  [C0603K]
C_U21  10 µF  C-EUC0805K  [C0805K]
C_U22  100 nF  C-EUC0603K  [C0603K]
C_U31  10 µF  C-EUC0805K  [C0805K]
C_U32  100 nF  C-EUC0603K  [C0603K]
CON_RASP  ML26  [ML26]
CON_USB2  PN61729-S  [PN61729-S]
CON_USB3  PN87520-S  [PN87520-S]
CON_USB4  PN61729-S  [PN61729-S]
CON_USB5  PN87520-S  [PN87520-S]
D2  1N5817-B  [DO41-7.6]
F2  1 A  SHK20L  [SHK20L]
IC_AD1  ADUM7442  [SOP64P600X175-16N]
K1  TR5V-M5  G5V1  [G5V1]
L_USB2  10µH/500mA  L-EUL1210  [L1210]
L_USB3  10µH/500mA  L-EUL1210  [L1210]
OK1  HCPL2601  [DIL08]
R_RLY1  150 R  R-EU_R0603  [R0603]

### Nets
0V: C_AD11.2 C_AD12.1 C_OK1.1 C_U21.2 C_U22.2 C_U31.2 C_U32.2 CON_RASP.6 CON_RASP.9 CON_RASP.14 CON_RASP.20 CON_RASP.25 CON_USB2.4 CON_USB3.4 CON_USB4.4 CON_USB5.4 IC_AD1.9(GND2) IC_AD1.15(GND2) OK1.5(GND) ; also sheet 3,4
+3V3: C_AD9.1 C_AD10.2 IC_AD1.1(VDD1) IC_AD1.7(VDD1) R_RLY1.1 ; also sheet 1,2,3,4
+5V: F2.1A F2.1B ; also sheet 3,4
GND: C_AD9.2 C_AD10.1 IC_AD1.2(GND1) IC_AD1.8(GND1) ; also sheet 1,2,3,4
N$5: D2.A K1.2 OK1.6(OUT)
N$18: CON_USB4.2 CON_USB5.2
N$19: CON_USB2.2 CON_USB3.2
N$20: CON_USB2.3 CON_USB3.3
N$21: CON_USB4.3 CON_USB5.3
N$22: OK1.2(A) R_RLY1.2
N$23: CON_USB5.1 L_USB3.2
N$24: CON_USB3.1 L_USB2.2
N$34: C_OK1.2 D2.C F2.2A F2.2B K1.5(2:P) K1.6(2:P) K1.9 OK1.7(EN) OK1.8(VCC)
PE: CON_USB2.S1 CON_USB2.S2 CON_USB3.S1 CON_USB3.S2 CON_USB4.S1 CON_USB4.S2 CON_USB5.S1 CON_USB5.S2 ; also sheet 2,3
R_3V3: C_AD11.1 C_AD12.2 CON_RASP.1 CON_RASP.17 IC_AD1.10(VDD2) IC_AD1.16(VDD2) ; supply symbol labelled +5V
R_5V: C_U21.1 C_U22.1 C_U31.1 C_U32.1 CON_RASP.2 CON_RASP.4 K1.10(2:S) L_USB2.1 L_USB3.1 ; supply symbol labelled +5V
R_GPIO_GCLK: CON_RASP.7
R_GPIO_GEN0: CON_RASP.11 IC_AD1.14(VOA)
R_GPIO_GEN1: CON_RASP.12 IC_AD1.11(VID)
R_GPIO_GEN2: CON_RASP.13
R_GPIO_GEN3: CON_RASP.15
R_GPIO_GEN4: CON_RASP.16
R_GPIO_GEN5: CON_RASP.18
R_GPIO_GEN6: CON_RASP.22
R_RXD0: CON_RASP.10 IC_AD1.13(VOB)
R_SCL1: CON_RASP.5
R_SDA1: CON_RASP.3
R_SPI_CE0_N: CON_RASP.24
R_SPI_CE1_N: CON_RASP.26
R_SPI_MISO: CON_RASP.21
R_SPI_MOSI: CON_RASP.19
R_SPI_SCLK: CON_RASP.23
R_TXD0: CON_RASP.8 IC_AD1.12(VIC)
RASP_BUSY: IC_AD1.6(VOD) ; also sheet 1
RASP_OFF: IC_AD1.3(VIA) ; also sheet 1
RASP_RELAY_T: OK1.3(C) ; also sheet 3
RASP_RX: IC_AD1.5(VOC) ; also sheet 1
RASP_TX: IC_AD1.4(VIB) ; also sheet 1
Unconnected: CON_USB2.1 CON_USB4.1 K1.1(2:O)

### Notes on the sheet
- Anschluss | Galvanische Trennung
- USB | Relais
- Raspberry | Peter Weissig

## Library data of the parts
C_AC1-C_AC3 C_AD1-C_AD12 C_AW1 C_DMX11 C_DMX12 C_DMX21 C_DMX22 C_DMX31 C_DMX32 C_E11-C_E14 C_E31-C_E34 C_EQ1 C_EQ2 C_ER1 C_ER2 C_ET1 C_ET2 C_FT1 C_FT2 C_JT1 C_L1 C_M31 C_M32 C_M51 C_M52 C_MA1 C_MA2 C_MC1 C_MC2 C_MV1-C_MV3 C_OK1 C_Q3 C_Q4 C_U11 C_U12 C_U21 C_U22 C_U31 C_U32 C_V1-C_V4 C_VX1 = rcl:C-EU: CAPACITOR, European symbol
CON_AD = con-harting-ml:ML14: HARTING; OC_FARNELL: unknown; OC_NEWARK: unknown
CON_AWR1 = con_ehp:AWIRE: aWire Autor: Peter Weissig Datum: 19.11.2013
CON_DMX0 CON_DMX1 CON_DMX2 CON_JT = con-harting-ml:ML10: HARTING; OC_FARNELL: unknown; OC_NEWARK: unknown
CON_ETH = SI-60062-F:SI-60062-F
CON_FO1-CON_FO3 = con-faston:PIN2: Flachstecker Typ Tyco/Electronics/AMP TAB, FASTON Printed Circuit Board Tabs Source: http://www.buerklin.com, http://catalog.tycoelectronics.com; OC_FARNELL: unknown; OC_NEWARK: unknown
CON_LED1 CON_LED2 = con-harting-ml:ML6: HARTING; OC_FARNELL: unknown; OC_NEWARK: unknown
CON_RASP = con-harting-ml:ML26: HARTING; OC_FARNELL: unknown; OC_NEWARK: unknown
CON_USB1 CON_USB2 CON_USB4 = con-berg:PN61729-S: BERG USB connector; OC_FARNELL: unknown; OC_NEWARK: unknown
CON_USB3 CON_USB5 = con-berg:PN87520-S; OC_FARNELL: unknown; OC_NEWARK: unknown
CON_VCC1 CON_VCC2 = con-wago-508:W237-02P: WAGO SREW CLAMP; OC_FARNELL: unknown; OC_NEWARK: unknown
D1 = PRTR5V0U2X:PRTR5V0U2X
D2 = diode:1N581*: 1.0A SCHOTTKY BARRIER RECTIFIER Source: http://www.diodes.com/datasheets/ds23001.pdf
F1-F3 = fuse:SHK20L: FUSE HOLDER 5 x 20 mm, SH contact, SHH1 Schukat, E1073 Buerklin; OC_FARNELL: unknown; OC_NEWARK: unknown
IC_AD1-IC_AD3 = adum140x:ADUM7442
IC_ETH = national-semiconductor:DP83848: PHYTER® - Extended Temperature Single Port 10/100 Mb/s Ethernet Physical Layer Transceiver Auto generated by make-symbol-device-package-bsdl.ulp Rev. 34 Source: dp83848yb.bsdl http://www.national.com/ds/DP/DP83848VYB.pdf; MPN: DP83848VYB; OC_FARNELL: 1286817; OC_NEWARK: 11N4484
IC_L1 = 74xx-eu:74*08: Quad 2-input AND gate
IC_MCU1 = atmel-avr32-michel:AT32UC3C1512/1256/1128: AT32UC3C1512/1256/1128
IC_T1 = uln-udn:ULN2003A: DRIVER ARRAY
K1 = relay:G5V1: RELAY 1 x switch, 0.5 A/125 V AC, 1 A/24 V DC , Omron; MPN: G5V-1-DC24; OC_FARNELL: 9949593; OC_NEWARK: 36M6377
L_USB1-L_USB3 = rcl-2:L-EU: INDUCTOR, European symbol
LED_S1-LED_S3 = led:LED: LED OSRAM: - CHIPLED LG R971, LG N971, LY N971, LG Q971, LY Q971, LO R971, LY R971 LH N974, LH R974 LS Q976, LO Q976, LY Q976 LO Q996 - Hyper CHIPLED LW Q18S LB Q993, LB Q99A, LB R99A - SideLED LS A670, LO A670, LY A670, LG A670, LP A670 LB A673, LV A673, LT A673, LW A673 LH A674 LY A675 LS A676, LA A676, LO A676, LY A676, LW A676 LS A679, LY A679, LG A679 - Hyper Micro SIDELED® LS Y876, LA Y876, LO Y876, LY Y876 LT Y87S - SmartLED LW L88C, LW L88S LB L89C, LB L89S, LG L890 LS L89K, LO L89K, LY L89K LS L896, LA L896, LO L896, LY L896 - TOPLED LS T670, LO T670, LY T670, LG T670, LP T670 LSG T670, LSP T670, LSY T670, LOP T670, LYG T670 LG T671, LOG T671, LSG T671 LB T673, LV T673, LT T673, LW T673 LH T674 LS T676, LA T676, LO T676, LY T676, LB T676, LH T676, LSB T676, LW T676 LB T67C, LV T67C, LT T67C, LS T67K, LO T67K, LY T67K, LW E67C LS E67B, LA E67B, LO E67B, LY E67B, LB E67C, LV E67C, LT E67C LW T67C LS T679, LY T679, LG T679 LS T770, LO T770, LY T770, LG T770, LP T770 LB T773, LV T773, LT T773, LW T773 LH T774 LS E675, LA E675, LY E675, LS T675 LS T776, LA T776, LO T776, LY T776, LB T776 LHGB T686 LT T68C, LB T68C - Hyper Mini TOPLED® LB M676 - Mini TOPLED Santana® LG M470 LS M47K, LO M47K, LY M47K Source: http://www.osram.convergy.de LUXEON: - LUMILED® LXK2-PW12-R00, LXK2-PW12-S00, LXK2-PW14-U00, LXK2-PW14-V00 LXK2-PM12-R00, LXK2-PM12-S00, LXK2-PM14-U00 LXK2-PE12-Q00, LXK2-PE12-R00, LXK2-PE12-S00, LXK2-PE14-T00, LXK2-PE14-U00 LXK2-PB12-K00, LXK2-PB12-L00, LXK2-PB12-M00, LXK2-PB14-N00, LXK2-PB14-P00, LXK2-PB14-Q00 LXK2-PR12-L00, LXK2-PR12-M00, LXK2-PR14-Q00, LXK2-PR14-R00 LXK2-PD12-Q00, LXK2-PD12-R00, LXK2-PD12-S00 LXK2-PH12-R00, LXK2-PH12-S00 LXK2-PL12-P00, LXK2-PL12-Q00, LXK2-PL12-R00 Source: www.luxeon.com KINGBRIGHT: KA-3528ASYC Source: www.kingbright.com
OK1 = optocoupler:HCPL2601: HEWLETT PACKARD OPTO COUPLER; MF: AGILENT TECHNOLOGIES; MPN: HCPL-2601-000E; OC_FARNELL: 9994882; OC_NEWARK: 88H7810
PWS1 = traco_electronic_ehp:TRACO: DC/DC-Konverter Autor: Peter Weissig Datum: 14.11.2013 Hersteller: Traco Power 1 x Input, 1 x Output
Q1 = crystal_ehp:CRYSTAL: SMD Quarz Autor: Peter Weissig Datum: 19.11.2013 Hersteller: Nihon Dempa Kogyo; OC_FARNELL: unknown; OC_NEWARK: unknown
Q2 = crystal_ehp:OSZILLATOR: SMD Quarz Autor: Peter Weissig Datum: 05.12.2013 Hersteller: EuroQuartz
R_AW1 R_EB1 R_EL1 R_EL2 R_ER1 R_ER2 R_ET1 R_ET2 R_EU1-R_EU4 R_FL1 R_FL2 R_FT11 R_FT12 R_FT21 R_FT22 R_LS1-R_LS3 R_RLY1 R_TF1 R_TF2 R_TR1 R_USB1 R_USB2 = rcl:R-EU_: RESISTOR, European symbol
R_V1 = varistor:VARISTOR: VARISTOR
S1 = switch-omron:10-XX: OMRON SWITCH; MPN: B3F-1000; OC_FARNELL: 176432; OC_NEWARK: 36M3542
TP_MCU1-TP_MCU7 = testpad:TP: Test pad